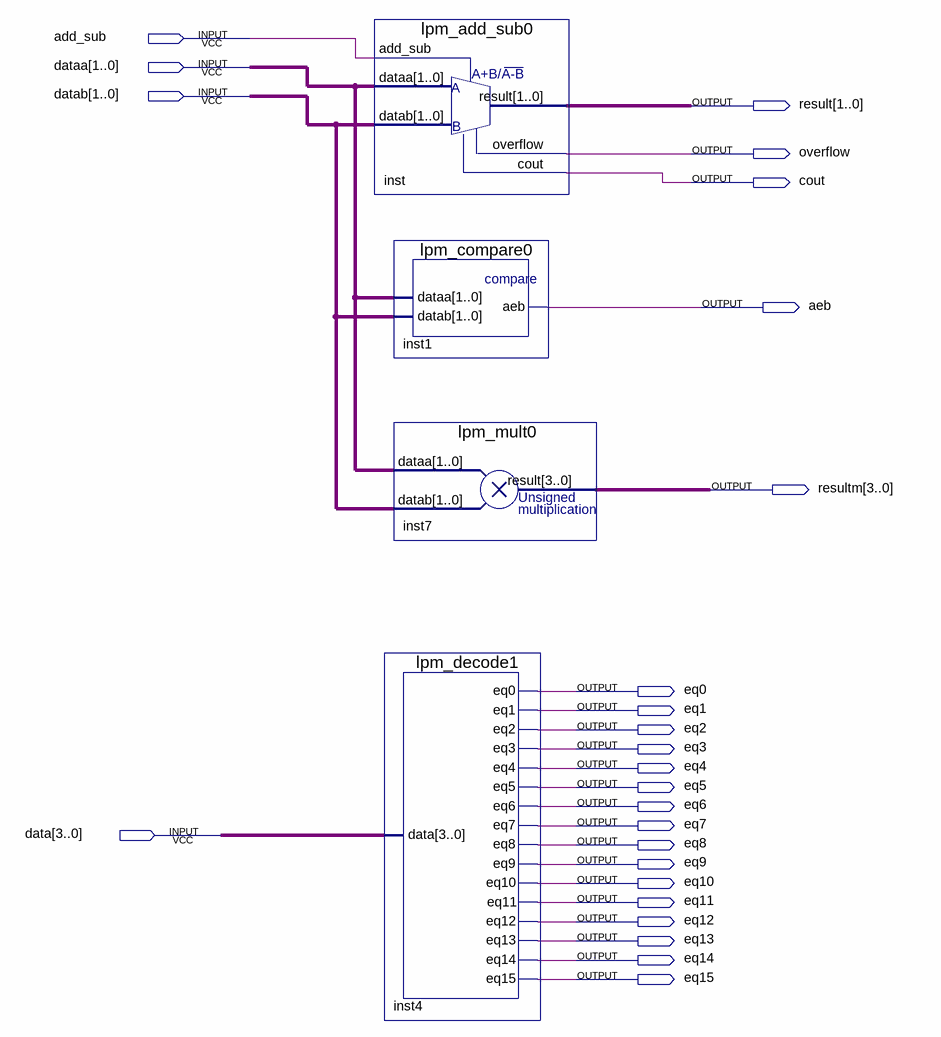
[diagram p0: schematic sheet]
// Quartus schematic megafuncionesejemplos.bdf as structural Verilog: 4 symbols, 25 pins
module megafuncionesejemplos (
  input  add_sub,
  input  [1:0] dataa,
  input  [1:0] datab,
  input  [3:0] data,
  output [1:0] result,
  output overflow,
  output cout,
  output aeb,
  output [3:0] resultm,
  output eq0,
  output eq1,
  output eq2,
  output eq3,
  output eq4,
  output eq5,
  output eq6,
  output eq7,
  output eq8,
  output eq9,
  output eq10,
  output eq11,
  output eq12,
  output eq13,
  output eq14,
  output eq15
);

  lpm_add_sub0 inst (
    .add_sub(add_sub), .dataa(dataa), .datab(datab), .result(result), .overflow(overflow), .cout(cout));
  lpm_decode1 inst4 (
    .data(data), .eq0(eq0), .eq1(eq1), .eq2(eq2), .eq3(eq3), .eq4(eq4), .eq5(eq5), .eq6(eq6), .eq7(eq7),
    .eq8(eq8), .eq9(eq9), .eq10(eq10), .eq11(eq11), .eq12(eq12), .eq13(eq13), .eq14(eq14), .eq15(eq15));
  lpm_compare0 inst1 (.dataa(dataa), .datab(datab), .aeb(aeb));
  lpm_mult0 inst7 (.dataa(dataa), .datab(datab), .result(resultm));
endmodule
